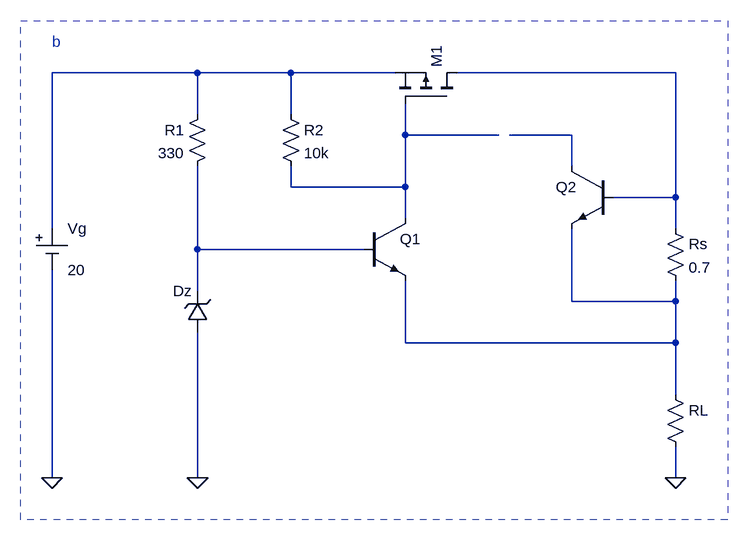
[diagram p0: schematic Ej 2.8b.asc]
Ej 2.8b.asc, the LTspice schematic file:
Version 4
SHEET 1 7772 18116
WIRE 6112 4016 5888 4016
WIRE 6256 4016 6112 4016
WIRE 6416 4016 6256 4016
WIRE 6848 4016 6512 4016
WIRE 6112 4080 6112 4016
WIRE 6256 4080 6256 4016
WIRE 6432 4112 6432 4064
WIRE 6576 4112 6432 4112
WIRE 6688 4112 6592 4112
WIRE 6688 4160 6688 4112
WIRE 6256 4192 6256 4160
WIRE 6432 4192 6432 4112
WIRE 6432 4192 6256 4192
WIRE 6848 4208 6848 4016
WIRE 6848 4208 6752 4208
WIRE 6432 4240 6432 4192
WIRE 5888 4256 5888 4016
WIRE 6848 4256 6848 4208
WIRE 6112 4288 6112 4160
WIRE 6368 4288 6112 4288
WIRE 6112 4352 6112 4288
WIRE 6688 4368 6688 4256
WIRE 6848 4368 6848 4336
WIRE 6848 4368 6688 4368
WIRE 6432 4432 6432 4336
WIRE 6848 4432 6848 4368
WIRE 6848 4432 6432 4432
WIRE 6848 4512 6848 4432
WIRE 5888 4640 5888 4320
WIRE 6112 4640 6112 4416
WIRE 6848 4640 6848 4592
FLAG 5888 4640 0
FLAG 6848 4640 0
FLAG 6112 4640 0
SYMBOL pmos 6512 4064 M270
WINDOW 3 56 72 Invisible 2
SYMATTR Value IRF9640
SYMATTR InstName M1
SYMBOL res 6832 4496 R0
WINDOW 3 36 76 Invisible 2
SYMATTR Value 10
SYMATTR InstName RL
SYMBOL zener 6128 4416 R180
WINDOW 0 24 64 Left 2
WINDOW 3 24 0 Invisible 2
SYMATTR InstName Dz
SYMATTR Value 1N750
SYMBOL npn 6368 4240 R0
WINDOW 3 56 68 Invisible 2
SYMATTR InstName Q1
SYMBOL res 6128 4064 M0
SYMATTR InstName R1
SYMATTR Value 330
SYMBOL res 6240 4064 R0
SYMATTR InstName R2
SYMATTR Value 10k
SYMBOL res 6832 4240 R0
SYMATTR InstName Rs
SYMATTR Value 0.7
SYMBOL npn 6752 4160 M0
WINDOW 3 56 68 Invisible 2
SYMATTR InstName Q2
SYMBOL Misc\\cell 5888 4256 R0
WINDOW 123 0 0 Left 0
WINDOW 39 0 0 Left 0
SYMATTR InstName Vg
SYMATTR Value 20
TEXT 5888 3968 Left 2 ;b
RECTANGLE Normal 6928 4704 5840 3936 2

The netlist it stands for:
* Ej 2.8b.asc
M1 N002 N003 N001 N001 IRF9640
RL N006 0 10
Dz 0 N005 1N750
Q1 N003 N005 N006 0 NPN
R1 N001 N005 330
R2 N001 N003 10k
Rs N002 N006 0.7
Q2 N004 N002 N006 0 NPN
Vg N001 0 20
.model D D
.lib standard.dio
.model NPN NPN
.model PNP PNP
.lib standard.bjt
.model NMOS NMOS
.model PMOS PMOS
.lib standard.mos
* b
.backanno
.end